# EAGLE design OxFloodNet_sensor (EAGLE 7.1.0)
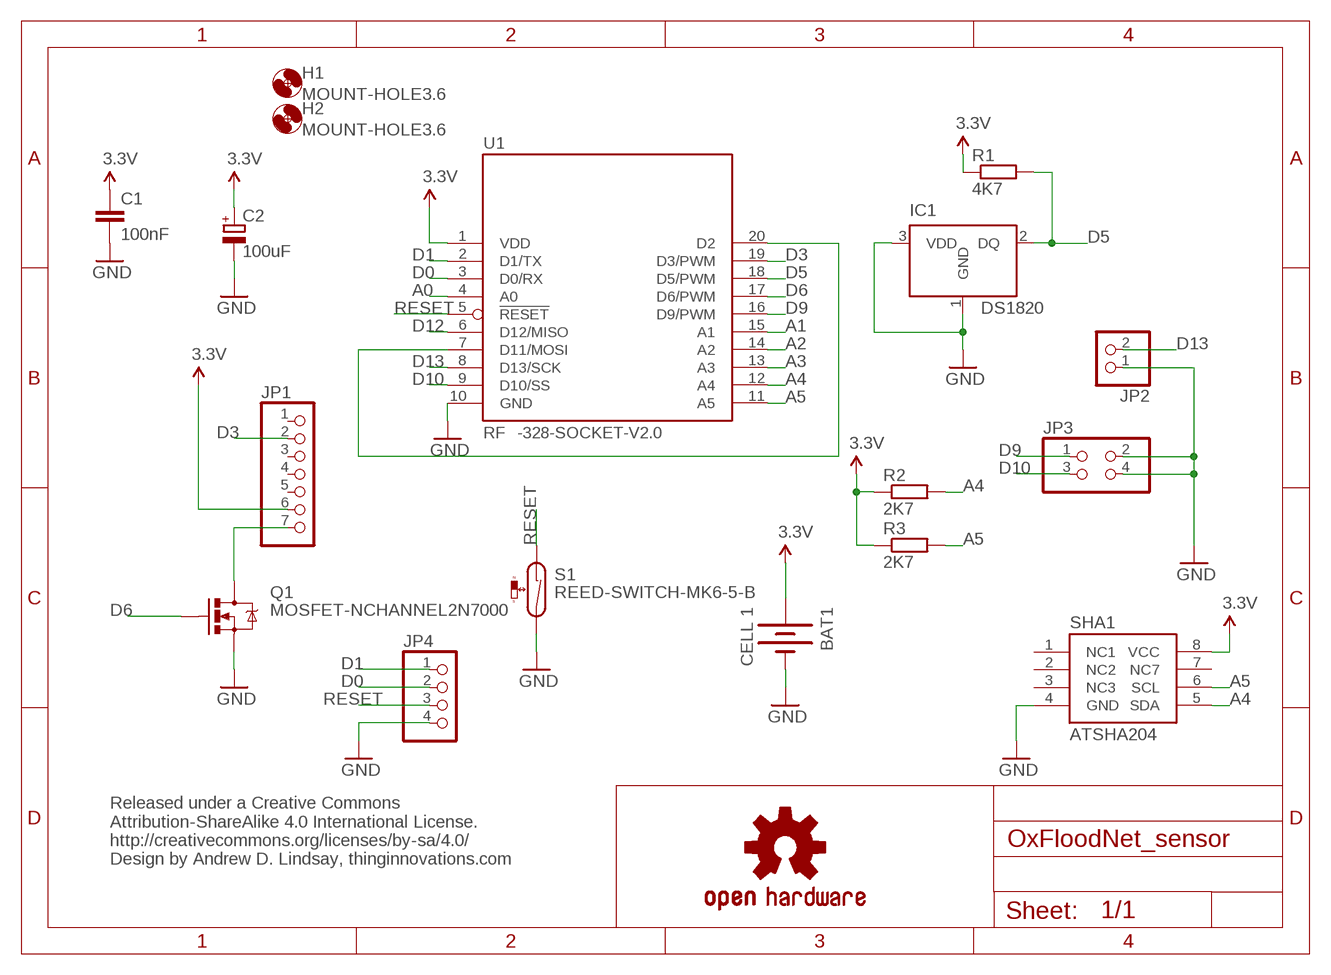
[diagram p0: schematic, sheet 1]

## Parts
BAT1  CELL 1  BATTERYAA  [BATTERY-AA]
C1  100nF  C-EU025-024X044  [C025-024X044]
C2  100uF  CPOL-EUE2,5-6E  [E2,5-6E]
H1  MOUNT-HOLE3.6  [3,6]
H2  MOUNT-HOLE3.6  [3,6]
IC1  DS1820  [TO-92]
JP1  1X07  [1X07]
JP2  1X02  [1X02]
JP3  2X02  [2X02]
JP4  PINHD-1X4  [1X04]
LOGO1  OSHW-LOGOM  [OSHW-LOGO-M]
Q1  MOSFET-NCHANNEL2N7000  [TO-92]
R1  4K7  R-EU_0207/7  [0207/7]
R2  2K7  R-EU_0207/7  [0207/7]
R3  2K7  R-EU_0207/7  [0207/7]
S1  REED-SWITCH-MK6-5-B  [MK6-5]
SHA1  ATSHA204  [SOIC8]
U1  RF�-328-SOCKET-V2.0  [RF�-SOCKET-V2.0]

## Nets
3.3V [3.3V]: BAT1.PWR@1(+) C1.1 C2.+ JP1.6 R1.1 R2.1 R3.1 SHA1.8(VCC) U1.1(VDD)
A0: U1.4(A0)
A1: U1.15(A1)
A2: U1.14(A2)
A3: U1.13(A3)
A4: R2.2 SHA1.5(SDA) U1.12(A4)
A5: R3.2 SHA1.6(SCL) U1.11(A5)
D0: JP4.2 U1.3(D0/RX)
D1: JP4.1 U1.2(D1/TX)
D3: JP1.2 U1.19(D3/PWM)
D5: IC1.2(DQ) R1.2 U1.18(D5/PWM)
D6: Q1.2(G) U1.17(D6/PWM)
D9: JP3.1 U1.16(D9/PWM)
D10: JP3.3 U1.9(D10/SS)
D12: U1.6(D12/MISO)
D13: JP2.2 U1.8(D13/SCK)
GND: BAT1.GND@1(-) C1.2 C2.- IC1.1(GND) IC1.3(VDD) JP2.1 JP3.2 JP3.4 JP4.4 Q1.1(S) S1.2 SHA1.4(GND) U1.10(GND)
N$1: U1.7(D11/MOSI) U1.20(D2)
N$2: JP1.7 Q1.3(D)
RESET: JP4.3 S1.1 U1.5(!RESET)
Unconnected: JP1.1 JP1.3 JP1.4 JP1.5 SHA1.1(NC1) SHA1.2(NC2) SHA1.3(NC3) SHA1.7(NC7)

## Notes on the sheet
- Released under a Creative Commons
  Attribution-ShareAlike 4.0 International License.
  http://creativecommons.org/licenses/by-sa/4.0/
  Design by Andrew D. Lindsay, thinginnovations.com

## Library data of the parts
BAT1 = SparkFun-Electromechanical:BATTERY: Battery Holders Various common sizes : AA, AAA, 20mm coin cell and 12mm coin cell. 20MM_4LEGS, BATT-10373
C1 = rcl:C-EU: CAPACITOR, European symbol
C2 = rcl:CPOL-EU: POLARIZED CAPACITOR, European symbol
H1 H2 = holes:MOUNT-HOLE: MOUNTING HOLE with drill center marker
IC1 = DS1820:DS1820: DS1820 - 1-Wire Digital Thermometer
JP1 = pinhead:1X07: PIN HEADER
JP2 = pinhead:1X02: PIN HEADER
JP3 = pinhead:2X02: PIN HEADER
JP4 = pinhead:PINHD-1X4: PIN HEADER
LOGO1 = SparkFun-Aesthetics:OSHW-LOGO: Open Source Hardware Logo This logo indicates the piece of hardware it is found on incorporates a OSHW license and/or adheres to the definition of open source hardware found here: http://freedomdefined.org/OSHW
Q1 = SparkFun-DiscreteSemi:MOSFET-NCHANNEL: Common NMOSFET Parts MFG P/N Store ID Prod ID FDD8780 TRANS-09984 SI7820DN TRANS-11055 FDS6630A IC-08089 2N7002PW TRANS-11151 FQP30N06L COM-10213 TRANS-10060 BSS123LT1G TRANS-08345 BSS138 TRANS-00830 BS170 2N7000
R1-R3 = resistor:R-EU_: RESISTOR, European symbol
S1 = switch-reed:REED-SWITCH-: Reed Sensor; MF: MEDER; MPN: MK6-5-B; OC_FARNELL: 1079479
SHA1 = ATSHA204:ATSHA204: ATSHA204
U1 = Ciseco Footprints:RF�-328

## Net classes
0 default: width 0.2 mm, clearance 0.205 mm
1 3.3V: width 0.4 mm, clearance 0.25 mm

## Board
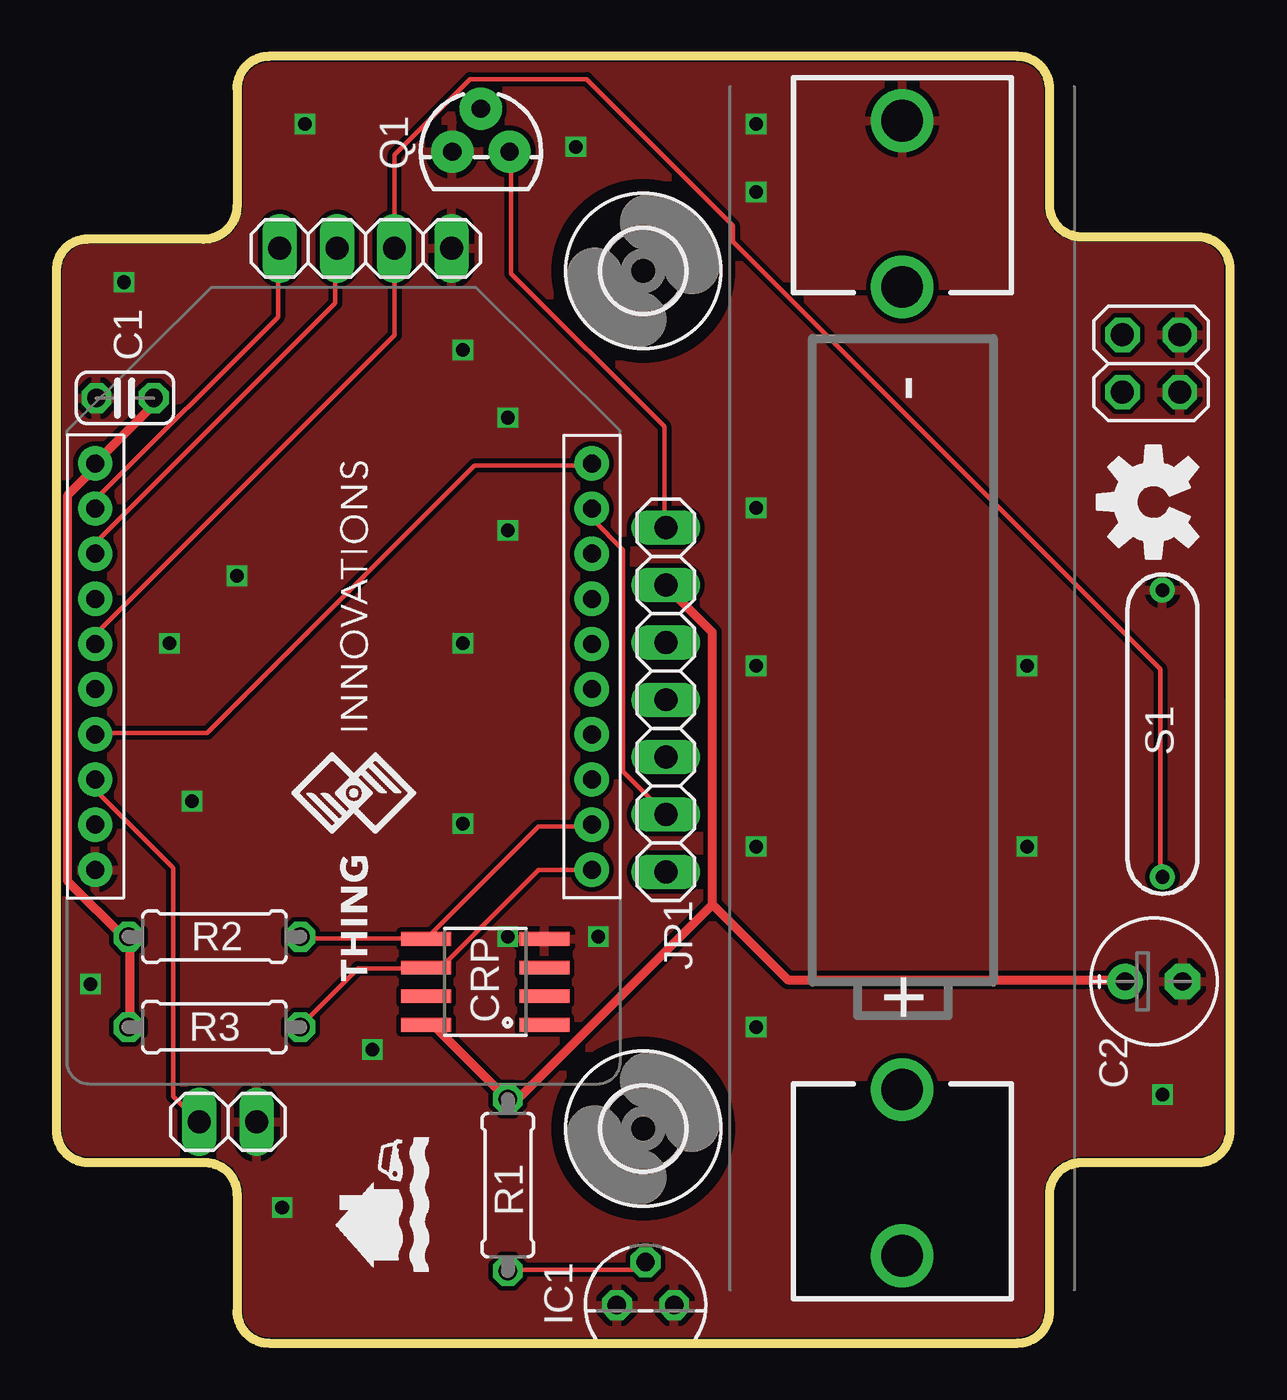
[diagram p1: board, top side]
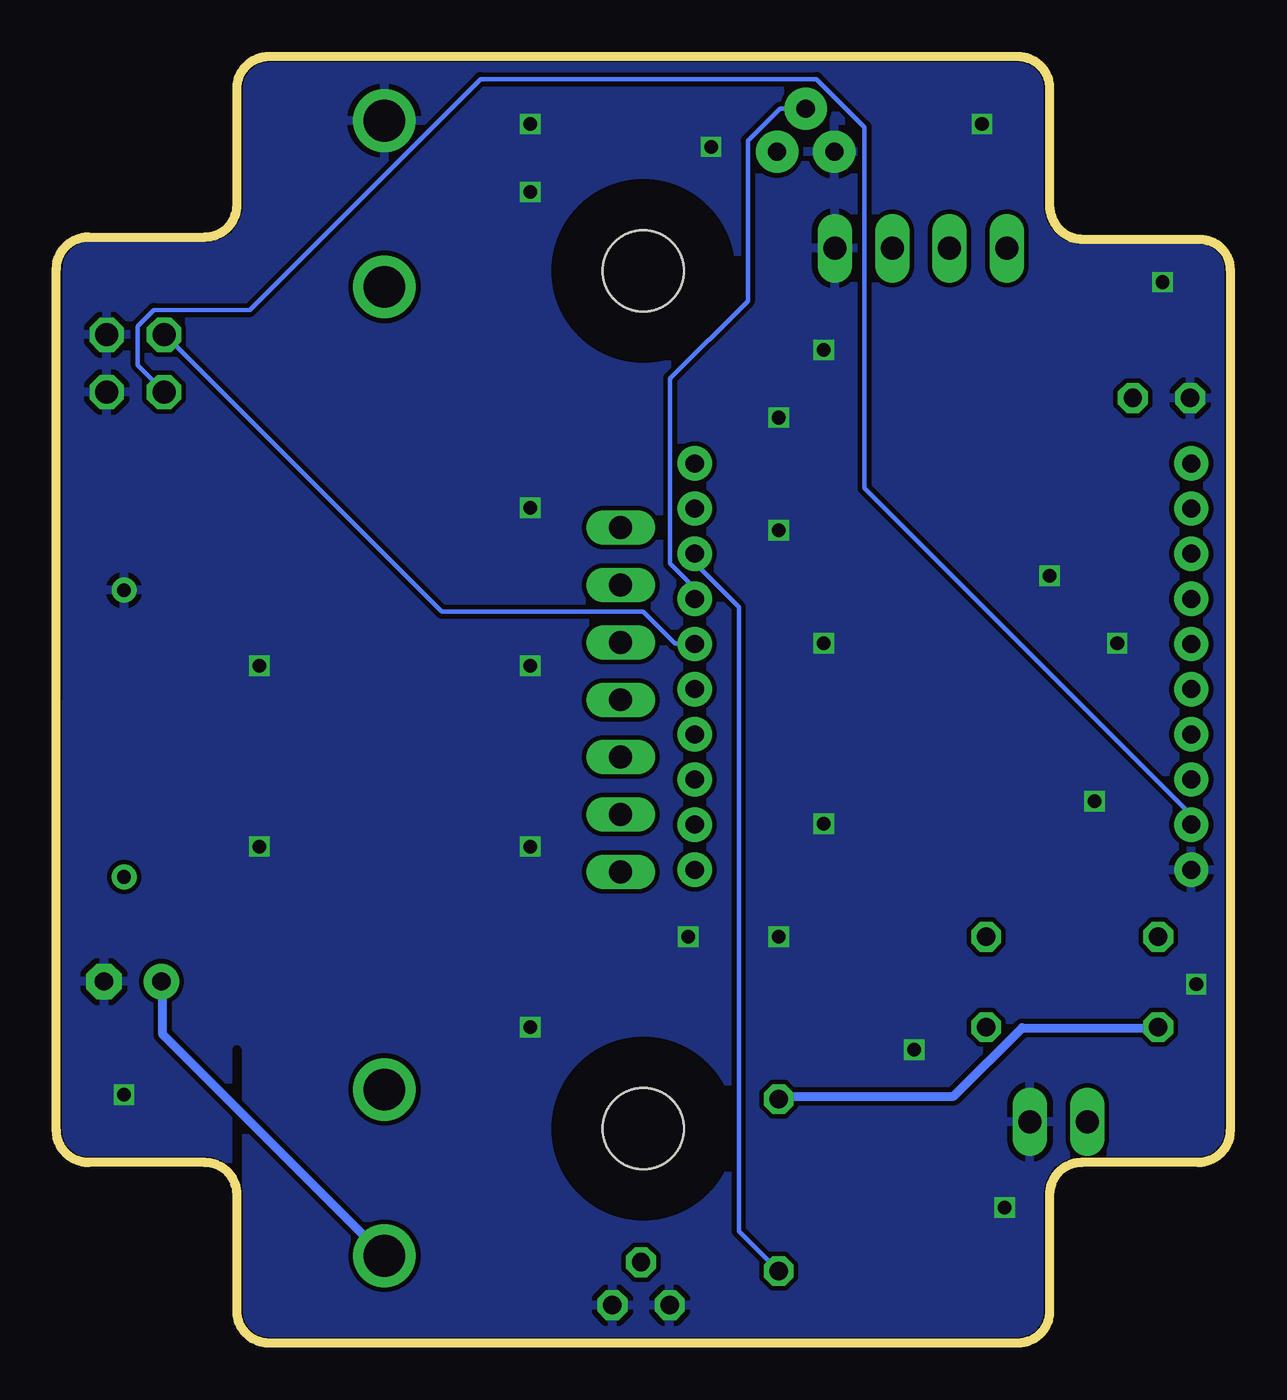
[diagram p2: board, bottom side, seen from below]

Size 52 x 57 mm. Coordinates in mm from the lower left corner, seen from the top.
Outline: 9.41,0 42.59,0 arc90 44,1.41 44,6.59 arc-90 45.41,8 50.59,8 arc90 52,9.42 51.98,47.61 arc90 50.55,49.04 45.39,49.04 arc-90 44,50.43 44,55.59 arc90 42.59,57 9.41,57 arc90 8,55.59 8,50.4 arc-90 6.54,48.94 1.37,48.94 arc90 0,47.57 0,9.41 arc90 1.41,8 6.59,8 arc-90 8,6.59 8,1.41 arc90 9.41,0
Copper layers (1*16): Top 0.035mm / dielectric 1.5mm / Bottom 0.035mm
Design rules "dirt_cheap_dirty_boards.v1": minimum track width 5mil, minimum drill 12mil, track to track 5mil, track to pad 5mil, pad to pad 5mil, via to via 5mil, smd to smd 0mil, copper to edge 10mil, drill to drill 10mil, minimum pad ring 10mil, minimum via ring 6mil, stop-mask expansion 2mil, vias tented up to drill 25mil, thermal gap 10mil
bRestrict: area 44,1 to 44,13
Milling: 24 lines

### Footprints (pad centres in the part's own frame; a part is rotated, then mirrored left to right if it is on the bottom)
BATTERY-AA = drill 1.854: GND@1 25.146,0; GND@2 17.78,0; PWR@1 -25.146,0; PWR@2 -17.78,0
C025-024X044 = drill 0.813 octagon: 1 -1.27,0; 2 1.27,0
E2,5-6E = drill 0.813 pad 1.575: + -1.27,0 | drill 0.813 pad 1.575 octagon: - 1.27,0
3,6 = hole 3.6: 0,0
TO-92 = drill 0.813 pad 1.27 octagon: 1 -1.27,0; 2 0,1.905; 3 1.27,0
1X07 = drill 1.016 long: 1 -7.62,0; 2 -5.08,0; 3 -2.54,0; 4 0,0; 5 2.54,0; 6 5.08,0; 7 7.62,0
1X02 = drill 1.016 long: 1 -1.27,0; 2 1.27,0
2X02 = drill 1.016 octagon: 1 -1.27,-1.27; 2 -1.27,1.27; 3 1.27,-1.27; 4 1.27,1.27
1X04 = drill 1.016 long: 1 -3.81,0; 2 -1.27,0; 3 1.27,0; 4 3.81,0
TO-92' = drill 0.813 pad 1.88: 1 -1.27,0; 2 0,1.905; 3 1.27,0
0207/7 = drill 0.813 octagon: 1 -3.81,0; 2 3.81,0
MK6-5 = drill 0.6 pad 1.016: 1 -6.35,0; 2 6.35,0
SOIC8 = smd 0.61 x 2.21: 1 -1.905,-2.616; 2 -0.635,-2.616; 3 0.635,-2.616; 4 1.905,-2.616; 5 1.905,2.616; 6 0.635,2.616; 7 -0.635,2.616; 8 -1.905,2.616
RF�-SOCKET-V2.0 = drill 0.8 pad 1.524: 1 -11,20; 2 -11,18; 3 -11,16; 4 -11,14; 5 -11,12; 6 -11,10; 7 -11,8; 8 -11,6; 9 -11,4; 10 -11,2; 11 11,2; 12 11,4; 13 11,6; 14 11,8; 15 11,10; 16 11,12; 17 11,14; 18 11,16; 19 11,18; 20 11,20

### Placement (x,y rotation side)
BAT1  37.47,29.01 90 top
C1  3.04,41.87 180 top
C2  48.62,16.02 0 top
H1  26,47.5 0 top
H2  26,9.5 0 top
IC1  26.1,1.68 0 top
JP1  27,28.5 90 top
JP2  7.6,9.8 180 top
JP3  48.5,43.4 270 top
JP4  13.7,48.5 0 top
LOGO1  48.6,37.26 90 top
Q1  MOSFET-NCHANNEL2N7000  [TO-92']  18.8,52.78 0 top
R1  20,7 270 top
R2  7,18 0 top
R3  7,14 0 top
S1  49,27 90 top
SHA1  19,16 90 top
U1  12.72,18.97 0 top
U$1  [THING_INNOVATIONS_SMALL]  16,16 90 top

### Tracks (layer width: path | path; a pad name or v marks a point on that pad's centre or on a via)
3.3V
  Top 0.4: C1.1 4.25,41.82 4.25,41.51 1.72,38.98 U1.1 1.72,38.78 0.51,37.56 0.51,20.45 3.04,17.92 R2.1 3.24,17.92 3.24,14.07 R3.1 | SHA1.8 16.4,14.07 16.71,14.07 19.95,10.83 R1.1 20.15,10.94 20.55,10.94 29.06,19.44 | 29.06,19.44 29.06,31.49 27.03,33.51 JP1.6 | 29.06,19.44 32.4,16.1 47.28,16.1 C2.+
  Bottom 0.4: C2.+ 47.28,16 47.28,13.67 37.56,3.95 BAT1.PWR@1 | R3.1 3.24,13.97 9.21,13.97 12.25,10.94 19.84,10.94 19.95,10.83 R1.1
A4
  Top 0.2: R2.2 10.83,17.92 16.3,17.92 SHA1.5 16.4,17.92 21.36,22.88 23.69,22.88 U1.12
A5
  Top 0.2: R3.2 10.83,14.07 13.37,16.61 16.3,16.61 SHA1.6 16.4,16.71 17.11,16.71 21.36,20.96 23.69,20.96 U1.11
D0
  Top 0.2: U1.3 1.72,35.03 1.72,35.44 12.35,46.07 12.35,48.5 JP4.2
D1
  Top 0.2: U1.2 1.72,37.06 1.72,37.36 9.82,45.46 9.82,48.5 JP4.1
D3
  Top 0.2: U1.19 23.79,36.96 23.79,36.45 25.11,35.13 25.11,25.31 26.93,23.49 JP1.2
D5
  Top 0.2: R1.2 20.05,3.24 25.72,3.24 26.02,3.54 IC1.2
  Bottom 0.2: U1.18 23.69,34.93 23.69,34.53 21.77,32.6 21.77,4.96 20.05,3.24 R1.2
D6
  Bottom 0.2: U1.17 23.79,33.01 23.79,33.51 24.81,34.53 24.81,42.73 21.36,46.17 21.36,53.26 19.95,54.67 18.83,54.67 Q1.2
D9
  Bottom 0.2: U1.16 23.79,30.98 24.6,30.98 26.02,32.4 34.93,32.4 47.18,44.65 JP3.1
D10
  Bottom 0.2: U1.9 1.72,22.98 1.72,23.39 16.2,37.87 16.2,53.87 18.33,55.99 33.21,55.99 43.44,45.77 47.69,45.77 48.4,45.06 48.4,43.34 47.28,42.22 JP3.3
D13
  Top 0.2: U1.8 1.72,24.91 1.72,24.5 5.16,21.06 5.16,10.94 6.28,9.82 JP2.2
GND  (via drill 0.6)
  other vias: 49,11 5,31 3,47 18,31 6,24 18,23 14,13 20,41 20,18 24,18 8,34 43,30 1.5,15.9 10,6 31,22 31,14 31,30 31,51 31,54 23,53 18,44 11,54 20,36 31,37 43,22
  pour Top: 8,0 44,0 44,8 52,8 52,49 44,49 44,57 8,57 8,49 0,49 0,8 8,8
  pour Bottom: 8,0 44,0 44,8 52,8 52,49 44,49 44,57 8,57 8,49 0,49 0,8 8,8
N$1
  Top 0.2: U1.7 1.72,27.03 6.68,27.03 18.53,38.88 23.69,38.88 U1.20
N$2
  Top 0.2: JP1.7 26.93,36.15 26.93,40.6 20.15,47.38 20.15,52.75 Q1.3
RESET
  Top 0.2: S1.1 48.9,20.66 48.9,29.87 29.97,48.8 29.97,49.51 23.49,55.99 18.33,55.99 14.98,52.65 14.98,48.6 JP4.3 14.98,48.4 14.98,44.65 1.72,31.39 1.72,30.98 U1.5

### Text on the board
tNames: CRP
tDocu: DBG | - | 2 | 1 | o | GND | RFu-328 | Tadiran 3.6V Battery / Observe correct polarity | Test | + | Oxford | Flood Network
bDocu: Oxford Flood Network Sensor V4.1 / oxfloodnet.co.uk / Design: Andrew D. Lindsay / thinginnovations.uk / Released under a Creative Commons / Attribution-ShareAlike 4.0 International License. / http://creativecommons.org/licenses/by-sa/4.0/